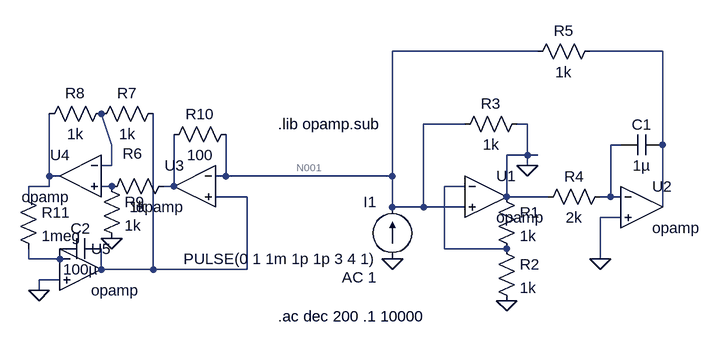
[diagram p0: schematic pset1.asc]
pset1.asc, the LTspice schematic file:
Version 4
SHEET 1 880 680
WIRE 288 -96 64 -96
WIRE 480 -96 368 -96
WIRE 176 16 112 16
WIRE 272 16 256 16
WIRE -368 48 -384 0
WIRE 416 48 400 48
WIRE 480 48 480 -96
WIRE 272 64 272 16
WIRE 272 64 240 64
WIRE 288 64 272 64
WIRE -368 80 -368 48
WIRE -368 80 -384 80
WIRE 272 80 272 64
WIRE -464 96 -464 0
WIRE -448 96 -464 96
WIRE -192 96 -192 32
WIRE -192 96 -208 96
WIRE 64 96 64 -96
WIRE 64 96 -192 96
WIRE -464 112 -464 96
WIRE -464 112 -496 112
WIRE -368 112 -384 112
WIRE -272 112 -272 32
WIRE -272 112 -288 112
WIRE 176 112 144 112
WIRE -496 128 -496 112
WIRE -160 128 -208 128
WIRE 240 128 240 64
WIRE 304 128 240 128
WIRE 400 128 400 48
WIRE 400 128 384 128
WIRE 416 128 400 128
WIRE 64 144 64 96
WIRE 112 144 112 16
WIRE 112 144 64 144
WIRE 176 144 112 144
WIRE 480 144 480 48
WIRE 416 160 384 160
WIRE 144 208 144 112
WIRE 240 208 144 208
WIRE -496 224 -496 208
WIRE -448 224 -448 208
WIRE -448 224 -496 224
WIRE 384 224 384 160
WIRE -384 240 -384 208
WIRE -304 240 -304 0
WIRE -304 240 -384 240
WIRE -160 240 -160 128
WIRE -160 240 -304 240
WIRE -448 256 -480 256
WIRE -480 272 -480 256
FLAG 240 288 0
FLAG 64 224 0
FLAG 384 224 0
FLAG 272 80 0
FLAG -480 272 0
FLAG -368 192 0
SYMBOL Opamps\\opamp 208 64 R0
SYMATTR InstName U1
SYMBOL res 224 112 R0
SYMATTR InstName R1
SYMATTR Value 1k
SYMBOL res 224 192 R0
SYMATTR InstName R2
SYMATTR Value 1k
SYMBOL res 272 0 R90
WINDOW 0 0 56 VBottom 0
WINDOW 3 32 56 VTop 0
SYMATTR InstName R3
SYMATTR Value 1k
SYMBOL current 64 224 R180
WINDOW 0 24 88 Left 0
WINDOW 3 24 0 Left 0
WINDOW 123 24 -28 Left 0
WINDOW 39 0 0 Left 0
SYMATTR InstName I1
SYMATTR Value PULSE(0 1 1m 1p 1p 3 4 1)
SYMATTR Value2 AC 1
SYMBOL Opamps\\opamp 448 80 R0
SYMATTR InstName U2
SYMBOL res 400 112 R90
WINDOW 0 0 56 VBottom 0
WINDOW 3 32 56 VTop 0
SYMATTR InstName R4
SYMATTR Value 2k
SYMBOL cap 480 32 R90
WINDOW 0 0 32 VBottom 0
WINDOW 3 32 32 VTop 0
SYMATTR InstName C1
SYMATTR Value 1µ
SYMBOL res 384 -112 R90
WINDOW 0 0 56 VBottom 0
WINDOW 3 32 56 VTop 0
SYMATTR InstName R5
SYMATTR Value 1k
SYMBOL Opamps\\opamp -240 48 M0
SYMATTR InstName U3
SYMBOL Opamps\\opamp -416 32 M0
SYMATTR InstName U4
SYMBOL Opamps\\opamp -416 176 R0
SYMATTR InstName U5
SYMBOL res -272 96 R90
WINDOW 0 -19 64 VBottom 0
WINDOW 3 32 56 VTop 0
SYMATTR InstName R6
SYMATTR Value 1k
SYMBOL res -288 -16 R90
WINDOW 0 0 56 VBottom 0
WINDOW 3 32 56 VTop 0
SYMATTR InstName R7
SYMATTR Value 1k
SYMBOL res -368 -16 R90
WINDOW 0 0 56 VBottom 0
WINDOW 3 32 56 VTop 0
SYMATTR InstName R8
SYMATTR Value 1k
SYMBOL res -384 96 R0
SYMATTR InstName R9
SYMATTR Value 1k
SYMBOL res -176 16 R90
WINDOW 0 0 56 VBottom 0
WINDOW 3 32 56 VTop 0
SYMATTR InstName R10
SYMATTR Value 100
SYMBOL res -512 112 R0
SYMATTR InstName R11
SYMATTR Value 1meg
SYMBOL cap -384 192 R90
WINDOW 0 0 32 VBottom 0
WINDOW 3 32 32 VTop 0
SYMATTR InstName C2
SYMATTR Value 100µ
TEXT -112 16 Left 0 !.lib opamp.sub
TEXT -112 312 Left 0 !.ac dec 200 .1 10000

The netlist it stands for:
* pset1.asc
XU1 N008 N001 0 opamp Aol=100K GBW=10Meg  ; pins invin noninvin out
R1 0 N008 1k
R2 N008 0 1k
R3 0 N001 1k
I1 0 N001 PULSE(0 1 1m 1p 1p 3 4 1) AC 1
XU2 N004 0 N002 opamp Aol=100K GBW=10Meg  ; pins invin noninvin out
R4 N004 0 2k
C1 N002 N004 1µ
R5 N002 N001 1k
XU3 N001 N009 N007 opamp Aol=100K GBW=10Meg  ; pins invin noninvin out
XU4 N003 N006 N005 opamp Aol=100K GBW=10Meg  ; pins invin noninvin out
XU5 N010 0 N009 opamp Aol=100K GBW=10Meg  ; pins invin noninvin out
R6 N007 N006 1k
R7 N009 N003 1k
R8 N003 N005 1k
R9 N006 0 1k
R10 N001 N007 100
R11 N005 N010 1meg
C2 N009 N010 100µ
.lib opamp.sub
.ac dec 200 .1 10000
.backanno
.end

* Results of the author's LTspice run, read from the files saved beside the schematic
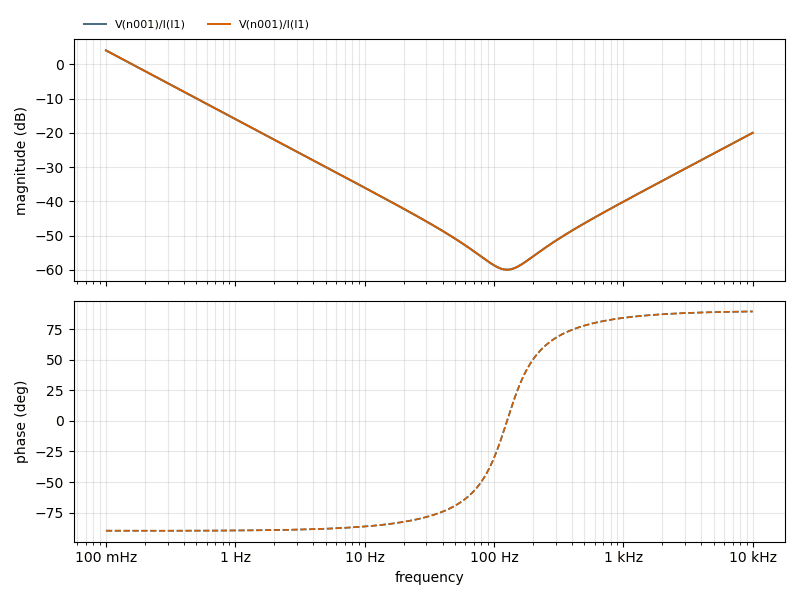
[diagram p1: AC Analysis of pset1.asc, plotted from the saved traces]
* AC Analysis, 1 run:
*   V(n001)/I(I1): 4.04 dB at 100 mHz, -20.00 dB at 10 kHz, peak 4.04 dB at 100 mHz, 3 dB below the peak at 141.4 mHz
*   V(n001)/I(I1): 4.04 dB at 100 mHz, -20.00 dB at 10 kHz, peak 4.04 dB at 100 mHz, 3 dB below the peak at 141.4 mHz